# EAGLE design lighthouse-lantern-v01 (EAGLE 6.3)
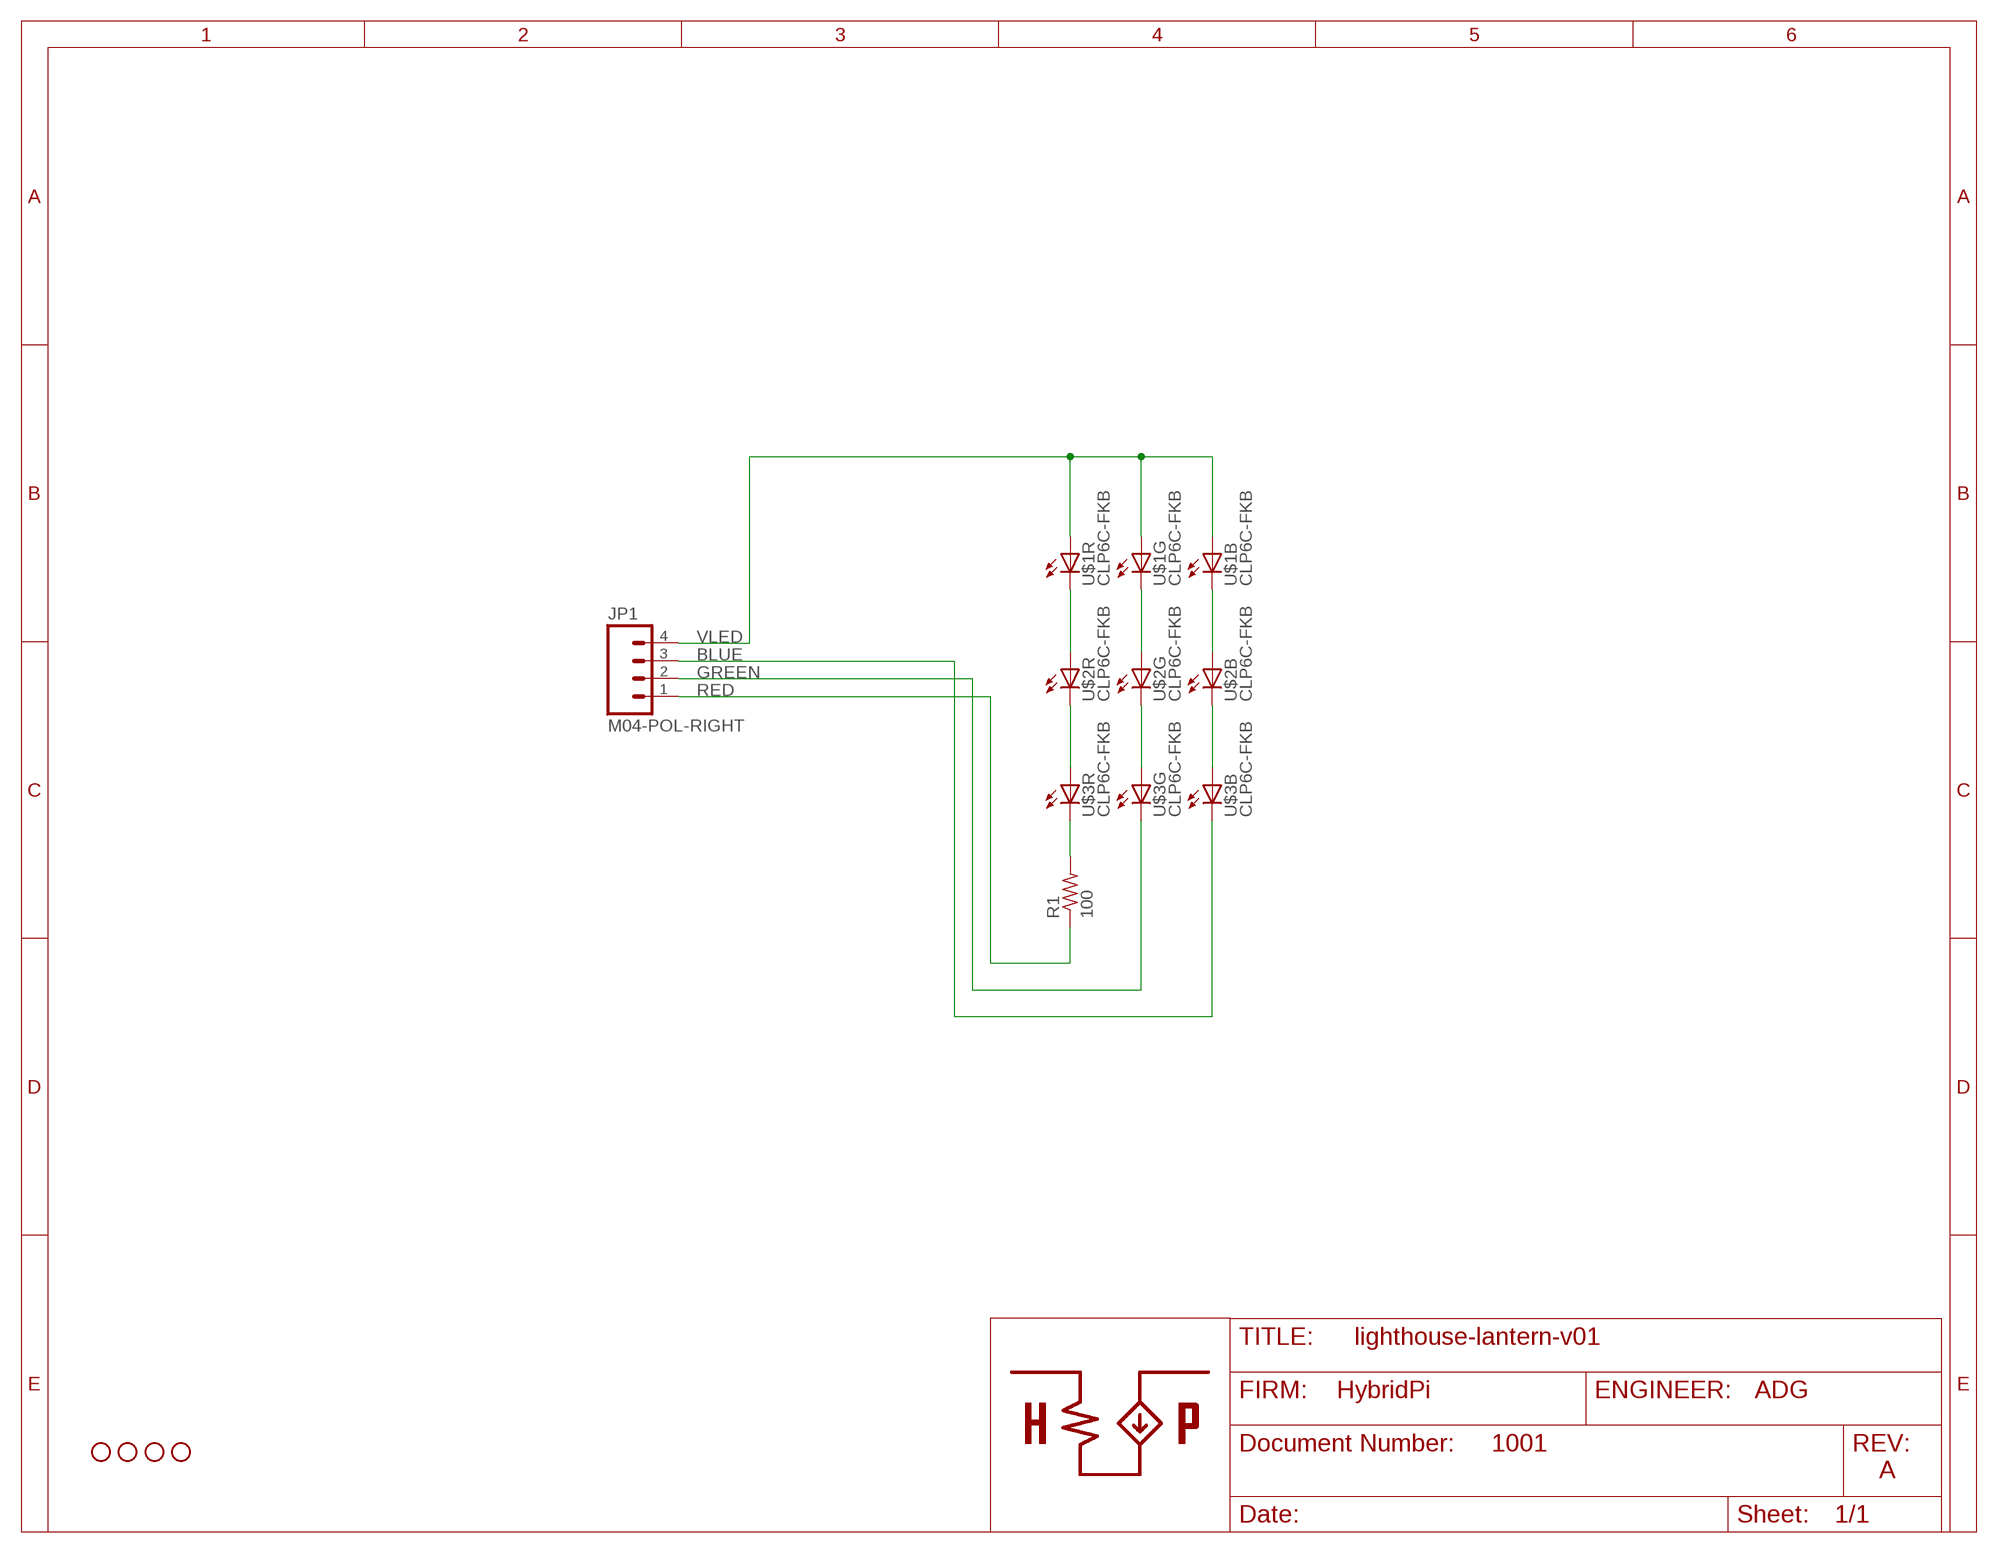
[diagram p0: schematic, sheet 1]

## Parts
JP1  M04-POL-RIGHT  [640455-4]
JP2  STAND-OFF  [STAND-OFF]
JP3  STAND-OFF  [STAND-OFF]
JP4  STAND-OFF  [STAND-OFF]
JP5  STAND-OFF  [STAND-OFF]
R1  100  R-US_R1206  [R1206]
U$1  CLP6C-FKB  [CLP6C-FKB]
U$2  CLP6C-FKB  [CLP6C-FKB]
U$3  CLP6C-FKB  [CLP6C-FKB]

## Nets
BLUE: JP1.3 U$3.4(B:C)
GREEN: JP1.2 U$3.5(G:C)
N$2: U$1.6(R:C) U$2.1(R:A)
N$3: U$1.5(G:C) U$2.2(G:A)
N$4: U$1.4(B:C) U$2.3(B:A)
N$5: U$2.4(B:C) U$3.3(B:A)
N$6: U$2.5(G:C) U$3.2(G:A)
N$7: U$2.6(R:C) U$3.1(R:A)
N$8: R1.2 U$3.6(R:C)
RED: JP1.1 R1.1
VLED: JP1.4 U$1.1(R:A) U$1.2(G:A) U$1.3(B:A)

## Notes on the sheet
- ADG
- 1001
- A

## Library data of the parts
JP1 = hybridpi:M04: 4 Position Connector Polarized Right: 640455-4 <http://www.te.com/catalog/pn/en/640455-4>; EAGLEUP: M04-640455-4-POL-RIGHT
JP2-JP5 = SparkFun-Electromechanical:STAND-OFF: #4 Stand Off This is the mechanical footprint for a #4 phillips button head screw. Use the keepout ring to avoid running the screw head into surrounding components. SKU : PRT-00447
R1 = resistor:R-US_: RESISTOR, American symbol; EAGLEUP: R1206
U$1-U$3 = hybridpi:CLP6C-FKB: RGB LED Cree 50mA SMD Datasheet: Cree <http://www.cree.com/~/media/Files/Cree/LED%20Components%20and%20Modules/HB/Data%20Sheets/CLP6CFKB(933).pdf>; EAGLEUP: CLP6C-FKB

## Board
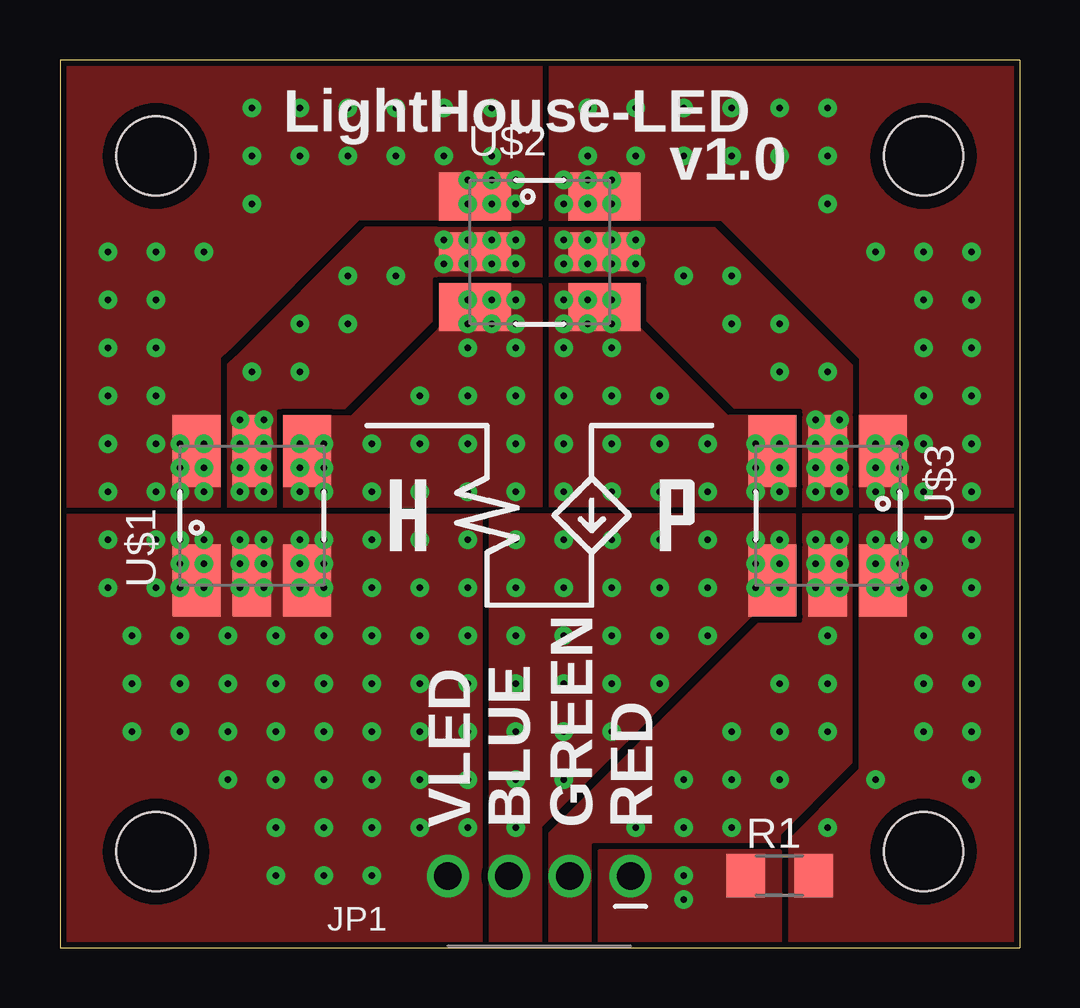
[diagram p1: board, top side]
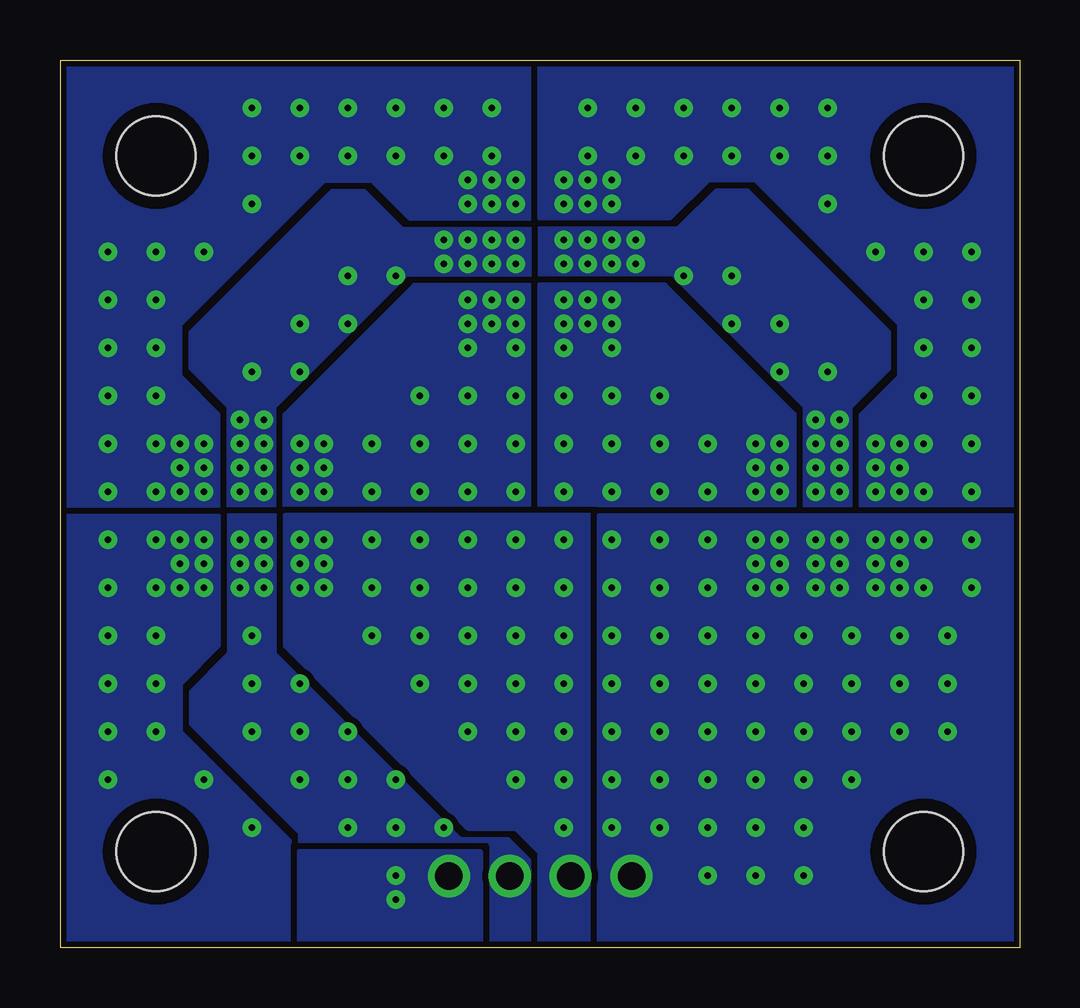
[diagram p2: board, bottom side, seen from below]

Size 40 x 37 mm. Coordinates in mm from the lower left corner, seen from the top.
Outline: 0,0 40,0 40,37 0,37 0,0
Copper layers (1*16): Top 0.035mm / dielectric 1.5mm / Bottom 0.035mm
Design rules "SparkFun": minimum track width 8mil, minimum drill 20mil, track to track 8mil, track to pad 8mil, pad to pad 8mil, via to via 8mil, smd to smd 8mil, copper to edge 10mil, drill to drill 8mil, minimum pad ring 12mil, minimum via ring 10mil, stop-mask expansion 4mil, vias tented up to drill 25mil, thermal gap 10mil

### Footprints (pad centres in the part's own frame; a part is rotated, then mirrored left to right if it is on the bottom)
640455-4 = drill 1.143: 1 -3.81,0; 2 -1.27,0; 3 1.27,0; 4 3.81,0
STAND-OFF = hole 3.302: 0,0
R1206 = smd 1.6 x 1.803: 1 -1.422,0; 2 1.422,0
CLP6C-FKB = smd 3 x 2: 1 -2.7,2.3; 3 -2.7,-2.3; 4 2.7,-2.3; 6 2.7,2.3 | smd 3 x 1.6: 2 -2.7,0; 5 2.7,0

### Placement (x,y rotation side)
JP1  19.98,2.98 180 top
JP2  4,4 0 top
JP3  36,4 0 top
JP4  4,33 0 top
JP5  36,33 0 top
R1  30,3 0 top
U$1  8,18 90 top
U$2  20,29 0 top
U$3  32,18 270 top

### Tracks (layer width: path | path; a pad name or v marks a point on that pad's centre or on a via)
BLUE  (via drill 0.25)
  other vias: 19,17 21,17 23,17 25,17 27,17 29,17 30,17 30,16 29,16 30,15 29,15 27,15 27,13 25,15 25,13 23,15 21,15 19,15 19,13 21,13 23,13 19,11 21,11 23,11 25,11 19,9 21,9 23,9 19,7 21,7 19,5
  pour Top (isolate 0.254, rank 2, no thermals): 30.6,18 17.5,18 17.5,0 20,0 20,3 20,5.1 28.8,13.9 30.6,13.9
  pour Bottom (isolate 0.254, rank 2, no thermals): 17.5,0 17.5,18 30.6,18 30.6,12.6 23,5 21,5 20,4 20,0
GREEN  (via drill 0.25)
  other vias: 31.5,17 32.5,17 31.5,16 32.5,16 32.5,15 31.5,15 32,13 32,11 32,9 30,11 30,9 30,7 28,7 28,9 26,7 28,5 26,5 24,5
  pour Top (isolate 0.254, rank 3, no thermals): 30.6,18 30.6,13.9 28.8,13.9 20,5.1 20,0 22.5,0 22.5,4 30,4 33.4,7.4 33.4,18
  pour Bottom (isolate 0.254, rank 3, no thermals): 33.4,18 33.4,12.6 35,11 35,9 30,4 22.5,4 22.5,0 20,0 20,4 21,5 23,5 29,11 30.6,12.6 30.6,18
N$2  (via drill 0.25)
  other vias: 2,19 4,19 4,21 2,21 5,21 6,21 6,20 5,20 5,19 6,19 4,23 2,23 4,25 2,25 4,27 2,27 2,29 4,29 6,29 8,31 8,33 8,35 10,35 10,33 12,33 12,35 14,35 14,33 16,35 16,33 18,35 18,33 19,32 19,31 18,32 18,31 17,32 17,31
  pour Top (isolate 0.254, rank 2, no thermals): 20,30.4 15.9,30.4 12.4,30.4 7,25 6.6,24.6 6.6,18 0,18 0,37 20,37
  pour Bottom (isolate 0.254, rank 2, no thermals): 6.6,18 6.6,22.2 5,23.8 5,26 11,32 13,32 14.6,30.4 20,30.4 20,37 0,37 0,18
N$3  (via drill 0.25)
  other vias: 7.5,19 8.5,19 8.5,20 7.5,20 7.5,21 8.5,21 8.5,22 7.5,22 8,24 10,24 10,26 12,26 12,28 14,28 16,28.5 16,29.5 17,29.5 17,28.5 18,28.5 18,29.5 19,29.5 19,28.5
  pour Top (isolate 0.254, rank 4, no thermals): 6.6,18 6.6,24.6 12.4,30.4 20,30.4 20,27.6 15.9,27.6 15.9,25.8 12.2,22.1 9.4,22.1 9.4,18
  pour Bottom (isolate 0.254, rank 4, no thermals): 6.6,18 6.6,22.2 5,23.8 5,26 11,32 13,32 14.6,30.4 20,30.4 20,27.6 14.8,27.6 9.4,22.2 9.4,18
N$4  (via drill 0.25)
  other vias: 10,21 11,21 10,20 11,20 10,19 11,19 13,21 13,19 15,19 17,19 17,21 15,21 15,23 17,23 19,23 19,21 19,19 19,25 17,25 17,26 18,26 19,26 19,27 18,27 17,27
  pour Top (isolate 0.254, rank 3, no thermals): 9.4,18 9.4,22.1 11.2,22.1 12.2,22.1 15.9,25.8 15.9,27.6 20,27.6 20,18
  pour Bottom (isolate 0.254, rank 3, no thermals): 9.4,18 9.4,22.2 14.8,27.6 20,27.6 20,18
N$5  (via drill 0.25)
  other vias: 30,21 30,20 30,19 29,19 29,20 29,21 27,19 27,21 25,21 25,19 23,19 23,21 21,21 21,19 21,23 23,23 25,23 23,25 21,25 21,26 22,26 23,26 23,27 22,27 21,27
  pour Top (isolate 0.254, rank 4, no thermals): 30.6,18 30.6,22.1 27.8,22.1 24.1,25.8 24.1,27.6 20,27.6 20,18
  pour Bottom (isolate 0.254, rank 4, no thermals): 30.6,18 30.6,22.2 25.2,27.6 20,27.6 20,18
N$6  (via drill 0.25)
  other vias: 31.5,19 32.5,19 32.5,20 31.5,20 31.5,21 32.5,21 32.5,22 31.5,22 32,24 30,24 30,26 28,26 28,28 26,28 24,28.5 24,29.5 23,28.5 23,29.5 22,28.5 22,29.5 21,28.5 21,29.5
  pour Top (isolate 0.254, rank 6, no thermals): 30.6,18 30.6,22.1 27.8,22.1 24.1,25.8 24.1,27.6 20,27.6 20,30.4 27.6,30.4 33.4,24.6 33.4,18
  pour Bottom (isolate 0.254, rank 6, no thermals): 33.4,18 33.4,22.2 35,23.8 35,26 29,32 27,32 25.4,30.4 20,30.4 20,27.6 24.2,27.6 25.2,27.6 30.6,22.2 30.6,18
N$7  (via drill 0.25)
  other vias: 21,31 22,31 23,31 23,32 22,32 21,32 22,33 24,33 24,35 22,35 26,35 26,33 28,33 28,35 30,35 30,33 32,31 32,33 32,35 34,29 36,29 38,29 38,27 36,27 36,25 38,25 36,23 38,23 38,21 36,21 36,19 38,19 35,19 35,20 35,21 34,21 34,20 34,19
  pour Top (isolate 0.254, rank 5, no thermals): 20,30.4 27.6,30.4 33,25 33.4,24.6 33.4,18 40,18 40,37 20,37
  pour Bottom (isolate 0.254, rank 5, no thermals): 33.4,18 33.4,22.2 35,23.8 35,25 35,26 29,32 27,32 25.4,30.4 20,30.4 20,37 40,37 40,18
N$8  (via drill 0.25)
  other vias: 34,17 35,17 34,16 35,16 34,15 35,15 36,17 38,17 36,15 38,15 38,13 36,13 38,11 36,11 36,9 38,9 38,7 32,5 34,7
  pour Top (isolate 0.254, rank 2, no thermals): 33.4,18 40,18 40,0 30,0 30,4 33.4,7.4
  pour Bottom (isolate 0.254, rank 2, no thermals): 33.4,18 33.4,12.6 35,11 35,9 30,4 30,0 40,0 40,18
RED  (via drill 0.25)
  other vias: 26,3 26,2
  pour Top (isolate 0.254, no thermals): 30,4 22.5,4 22.5,0 30,0
  pour Bottom (isolate 0.254, no thermals): 30,0 30,4 22.5,4 22.5,0
VLED  (via drill 0.25)
  other vias: 2,17 2,15 4,17 5,17 5,16 6,17 6,16 6,15 5,15 4,15 7.5,17 8.5,17 7.5,16 8.5,16 8.5,15 7.5,15 10,17 11,17 11,16 10,15 10,16 11,15 13,17 15,17 17,17 17,15 15,15 13,15 17,13 15,13 13,13 11,13 9,13 7,13 5,13 3,13 3,11 5,11 7,11 9,11 11,11 13,11 15,11 17,11 17,9 15,9 13,9 11,9 9,9 7,9 5,9 3,9 7,7 9,7 11,7 13,7 15,7 17,7 17,5 15,5 13,5 11,5 9,5 9,3 11,3 13,3
  pour Top (isolate 0.254, no thermals): 0,18 17.5,18 17.5,0 0,0
  pour Bottom (isolate 0.254, no thermals): 0,18 0,0 17.5,0 17.5,18

### Text on the board
tPlace: LightHouse-LED | v1.0 | VLED | BLUE | GREEN | RED